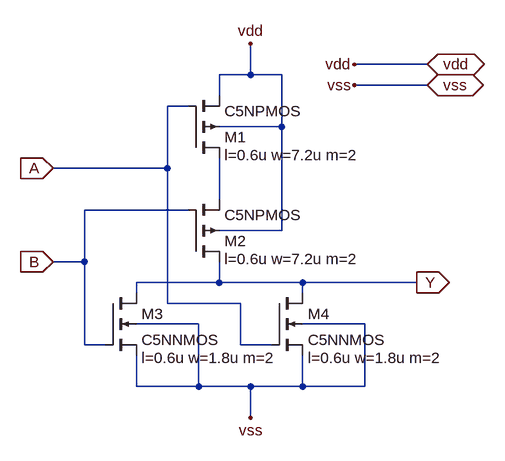
[diagram p0: schematic nor2_2x.asc]
nor2_2x.asc, the LTspice schematic file:
Version 4
SHEET 1 880 680
WIRE 16 -80 -96 -80
WIRE -256 -64 -256 -112
WIRE -256 -64 -304 -64
WIRE -208 -64 -256 -64
WIRE 16 -48 -96 -48
WIRE -304 -32 -304 -64
WIRE -352 -16 -384 -16
WIRE -208 16 -208 -64
WIRE -208 16 -304 16
WIRE -384 80 -384 -16
WIRE -384 80 -560 80
WIRE -304 128 -304 64
WIRE -352 144 -512 144
WIRE -208 176 -208 16
WIRE -208 176 -304 176
WIRE -512 224 -512 144
WIRE -512 224 -560 224
WIRE -304 256 -304 224
WIRE -304 256 -432 256
WIRE -176 256 -304 256
WIRE 0 256 -176 256
WIRE -432 272 -432 256
WIRE -176 272 -176 256
WIRE -384 288 -384 80
WIRE -272 288 -384 288
WIRE -336 320 -432 320
WIRE -80 320 -176 320
WIRE -512 352 -512 224
WIRE -480 352 -512 352
WIRE -272 352 -272 288
WIRE -224 352 -272 352
WIRE -432 416 -432 368
WIRE -336 416 -336 320
WIRE -336 416 -432 416
WIRE -256 416 -336 416
WIRE -176 416 -176 368
WIRE -176 416 -256 416
WIRE -80 416 -80 320
WIRE -80 416 -176 416
WIRE -256 464 -256 416
FLAG -560 80 A
IOPIN -560 80 In
FLAG 0 256 Y
IOPIN 0 256 Out
FLAG -560 224 B
IOPIN -560 224 In
FLAG 16 -80 vdd
IOPIN 16 -80 BiDir
FLAG 16 -48 vss
IOPIN 16 -48 BiDir
FLAG -96 -80 vdd
FLAG -96 -48 vss
FLAG -256 -112 vdd
FLAG -256 464 vss
SYMBOL pmos4 -352 64 M180
WINDOW 123 56 4 Left 2
SYMATTR Value2 l=0.6u w=7.2u m=2
SYMATTR InstName M1
SYMATTR Value C5NPMOS
SYMBOL pmos4 -352 224 M180
WINDOW 123 56 4 Left 2
SYMATTR Value2 l=0.6u w=7.2u m=2
SYMATTR InstName M2
SYMATTR Value C5NPMOS
SYMBOL nmos4 -224 272 R0
WINDOW 123 56 100 Left 2
SYMATTR Value2 l=0.6u w=1.8u m=2
SYMATTR InstName M4
SYMATTR Value C5NNMOS
SYMBOL nmos4 -480 272 R0
WINDOW 123 56 100 Left 2
SYMATTR Value2 l=0.6u w=1.8u m=2
SYMATTR InstName M3
SYMATTR Value C5NNMOS

The netlist it stands for:
* nor2_2x.asc
M1 N001 A vdd vdd C5NPMOS l=0.6u w=7.2u m=2
M2 Y B N001 vdd C5NPMOS l=0.6u w=7.2u m=2
M4 Y A vss vss C5NNMOS l=0.6u w=1.8u m=2
M3 Y B vss vss C5NNMOS l=0.6u w=1.8u m=2
.model NMOS NMOS
.model PMOS PMOS
.lib standard.mos
.backanno
.end